# Altium schematic sheet FETS.SchDoc
size B; Address1: MILWAUKEE TOOL; Address2: 13135 W. Lisbon Rd.; Address3: Brookfield, WI 53005; SheetNumber: 1; SheetTotal: 1
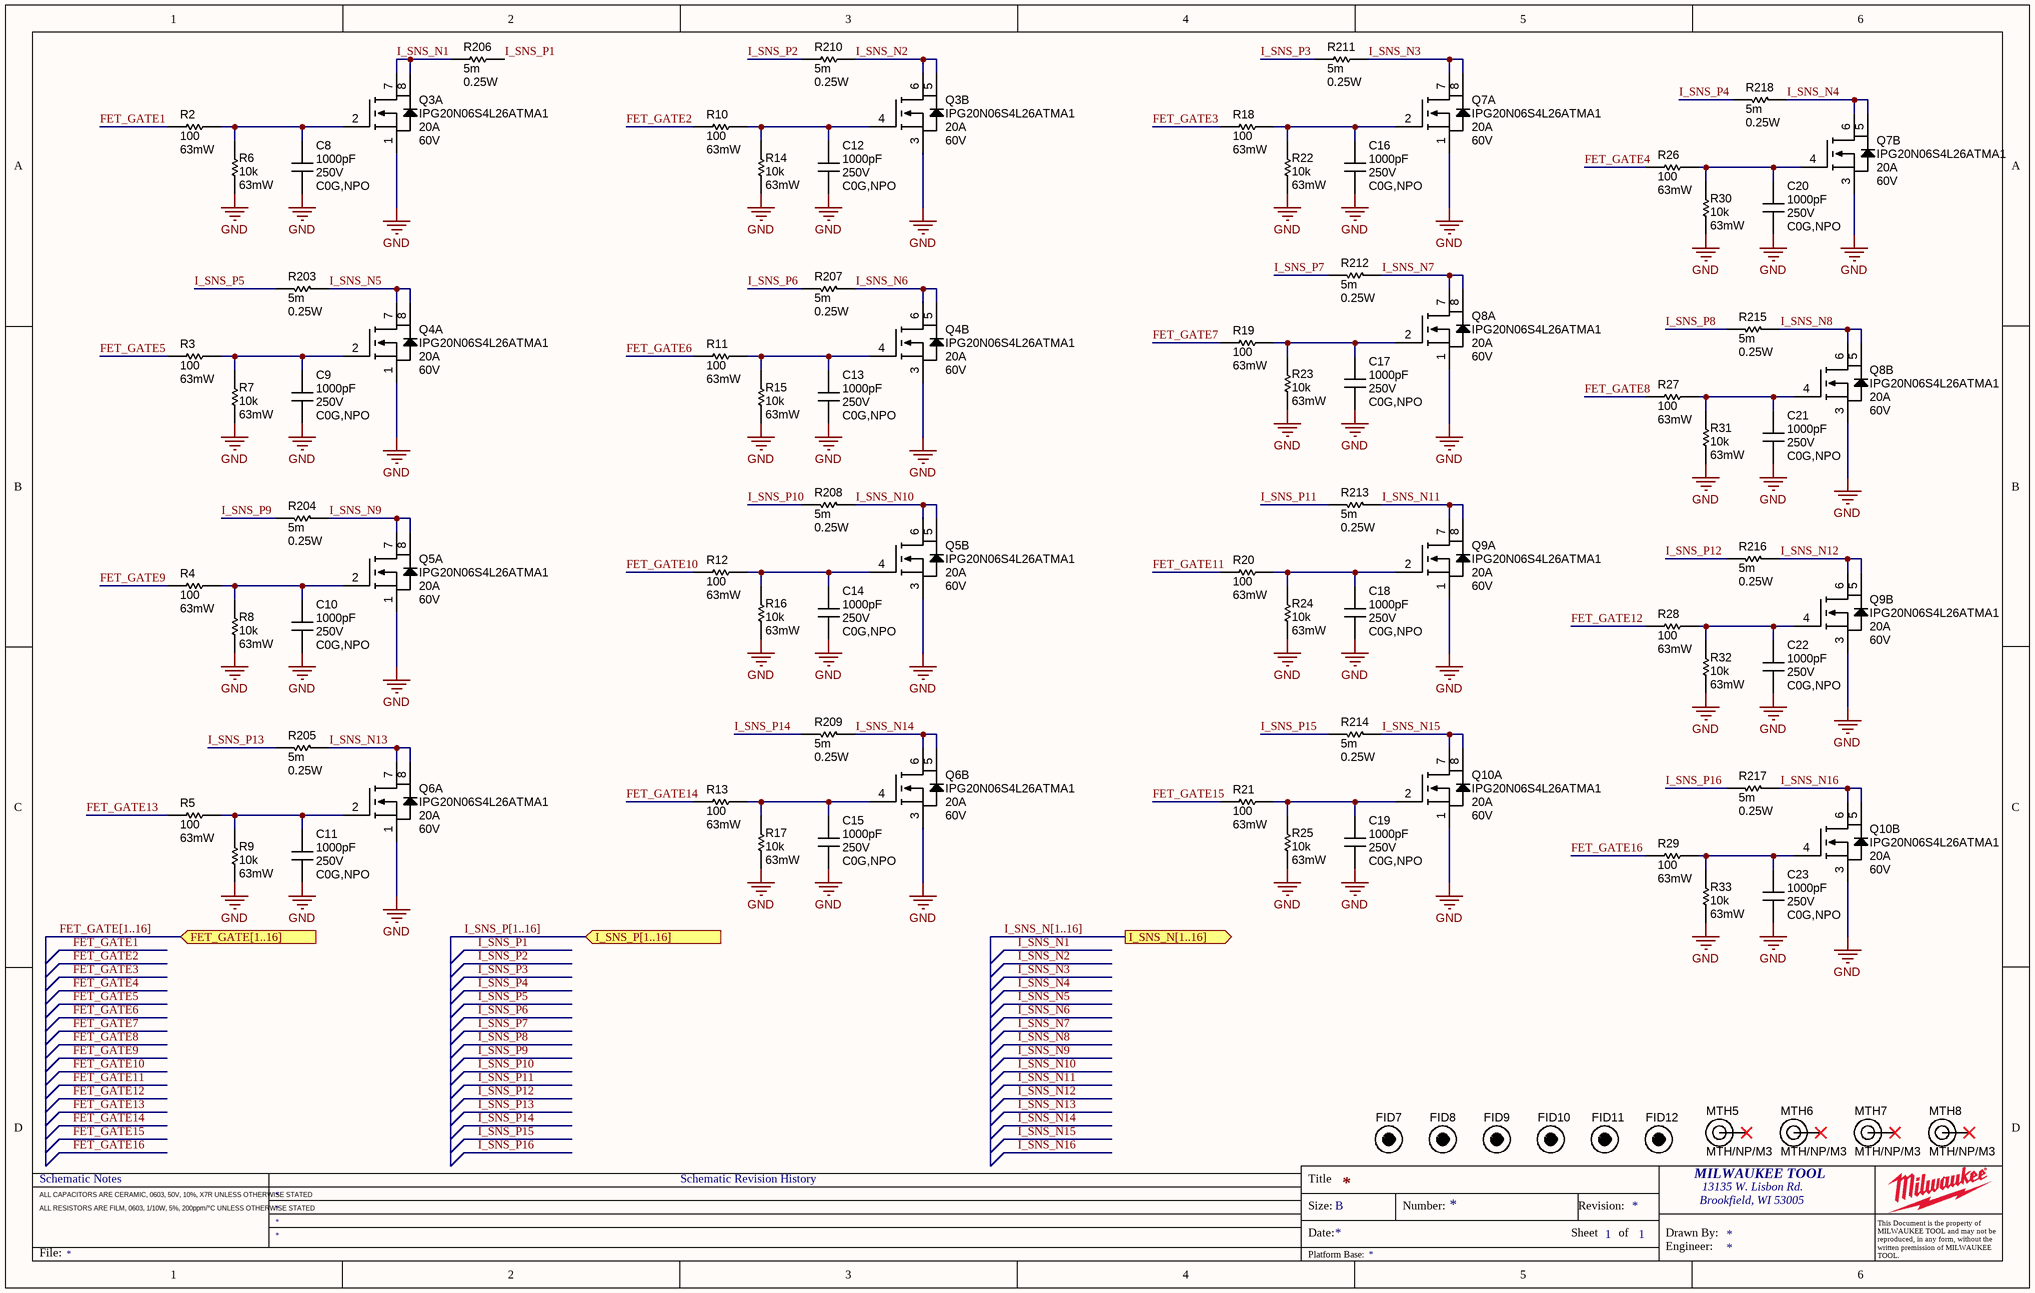
[diagram p0: FETS.SchDoc]

## Parts
C8  1000pF  Voltage Rating: 250V  Temp Coeff: C0G,NPO  [CAPC1608X09N]
C9  1000pF  Voltage Rating: 250V  Temp Coeff: C0G,NPO  [CAPC1608X09N]
C10  1000pF  Voltage Rating: 250V  Temp Coeff: C0G,NPO  [CAPC1608X09N]
C11  1000pF  Voltage Rating: 250V  Temp Coeff: C0G,NPO  [CAPC1608X09N]
C12  1000pF  Voltage Rating: 250V  Temp Coeff: C0G,NPO  [CAPC1608X09N]
C13  1000pF  Voltage Rating: 250V  Temp Coeff: C0G,NPO  [CAPC1608X09N]
C14  1000pF  Voltage Rating: 250V  Temp Coeff: C0G,NPO  [CAPC1608X09N]
C15  1000pF  Voltage Rating: 250V  Temp Coeff: C0G,NPO  [CAPC1608X09N]
C16  1000pF  Voltage Rating: 250V  Temp Coeff: C0G,NPO  [CAPC1608X09N]
C17  1000pF  Voltage Rating: 250V  Temp Coeff: C0G,NPO  [CAPC1608X09N]
C18  1000pF  Voltage Rating: 250V  Temp Coeff: C0G,NPO  [CAPC1608X09N]
C19  1000pF  Voltage Rating: 250V  Temp Coeff: C0G,NPO  [CAPC1608X09N]
C20  1000pF  Voltage Rating: 250V  Temp Coeff: C0G,NPO  [CAPC1608X09N]
C21  1000pF  Voltage Rating: 250V  Temp Coeff: C0G,NPO  [CAPC1608X09N]
C22  1000pF  Voltage Rating: 250V  Temp Coeff: C0G,NPO  [CAPC1608X09N]
C23  1000pF  Voltage Rating: 250V  Temp Coeff: C0G,NPO  [CAPC1608X09N]
FID7  FIDUCIAL STANDARD  [FID]  (value not drawn)  (no BOM)
FID8  FIDUCIAL STANDARD  [FID]  (value not drawn)  (no BOM)
FID9  FIDUCIAL STANDARD  [FID]  (value not drawn)  (no BOM)
FID10  FIDUCIAL STANDARD  [FID]  (value not drawn)  (no BOM)
FID11  FIDUCIAL STANDARD  [FID]  (value not drawn)  (no BOM)
FID12  FIDUCIAL STANDARD  [FID]  (value not drawn)  (no BOM)
MTH5  MTH/NP/M3  [MTGNP700H325Z700P]  (no BOM)
MTH6  MTH/NP/M3  [MTGNP700H325Z700P]  (no BOM)
MTH7  MTH/NP/M3  [MTGNP700H325Z700P]  (no BOM)
MTH8  MTH/NP/M3  [MTGNP700H325Z700P]  (no BOM)
Q3  IPG20N06S4L26ATMA1  Current: 20A  Voltage: 60V  [INF-PG-TDSON-8-4]  (parts A,B of 2)
Q4  IPG20N06S4L26ATMA1  Current: 20A  Voltage: 60V  [INF-PG-TDSON-8-4]  (parts A,B of 2)
Q5  IPG20N06S4L26ATMA1  Current: 20A  Voltage: 60V  [INF-PG-TDSON-8-4]  (parts A,B of 2)
Q6  IPG20N06S4L26ATMA1  Current: 20A  Voltage: 60V  [INF-PG-TDSON-8-4]  (parts A,B of 2)
Q7  IPG20N06S4L26ATMA1  Current: 20A  Voltage: 60V  [INF-PG-TDSON-8-4]  (parts A,B of 2)
Q8  IPG20N06S4L26ATMA1  Current: 20A  Voltage: 60V  [INF-PG-TDSON-8-4]  (parts A,B of 2)
Q9  IPG20N06S4L26ATMA1  Current: 20A  Voltage: 60V  [INF-PG-TDSON-8-4]  (parts A,B of 2)
Q10  IPG20N06S4L26ATMA1  Current: 20A  Voltage: 60V  [INF-PG-TDSON-8-4]  (parts A,B of 2)
R2  100  Wattage: 63mW  [RESC1005X04N]
R3  100  Wattage: 63mW  [RESC1005X04N]
R4  100  Wattage: 63mW  [RESC1005X04N]
R5  100  Wattage: 63mW  [RESC1005X04N]
R6  10k  Wattage: 63mW  [RESC1005X04N]
R7  10k  Wattage: 63mW  [RESC1005X04N]
R8  10k  Wattage: 63mW  [RESC1005X04N]
R9  10k  Wattage: 63mW  [RESC1005X04N]
R10  100  Wattage: 63mW  [RESC1005X04N]
R11  100  Wattage: 63mW  [RESC1005X04N]
R12  100  Wattage: 63mW  [RESC1005X04N]
R13  100  Wattage: 63mW  [RESC1005X04N]
R14  10k  Wattage: 63mW  [RESC1005X04N]
R15  10k  Wattage: 63mW  [RESC1005X04N]
R16  10k  Wattage: 63mW  [RESC1005X04N]
R17  10k  Wattage: 63mW  [RESC1005X04N]
R18  100  Wattage: 63mW  [RESC1005X04N]
R19  100  Wattage: 63mW  [RESC1005X04N]
R20  100  Wattage: 63mW  [RESC1005X04N]
R21  100  Wattage: 63mW  [RESC1005X04N]
R22  10k  Wattage: 63mW  [RESC1005X04N]
R23  10k  Wattage: 63mW  [RESC1005X04N]
R24  10k  Wattage: 63mW  [RESC1005X04N]
R25  10k  Wattage: 63mW  [RESC1005X04N]
R26  100  Wattage: 63mW  [RESC1005X04N]
R27  100  Wattage: 63mW  [RESC1005X04N]
R28  100  Wattage: 63mW  [RESC1005X04N]
R29  100  Wattage: 63mW  [RESC1005X04N]
R30  10k  Wattage: 63mW  [RESC1005X04N]
R31  10k  Wattage: 63mW  [RESC1005X04N]
R32  10k  Wattage: 63mW  [RESC1005X04N]
R33  10k  Wattage: 63mW  [RESC1005X04N]
R203  5m  Wattage: 0.25W  [RESC3115X07N]
R204  5m  Wattage: 0.25W  [RESC3115X07N]
R205  5m  Wattage: 0.25W  [RESC3115X07N]
R206  5m  Wattage: 0.25W  [RESC3115X07N]
R207  5m  Wattage: 0.25W  [RESC3115X07N]
R208  5m  Wattage: 0.25W  [RESC3115X07N]
R209  5m  Wattage: 0.25W  [RESC3115X07N]
R210  5m  Wattage: 0.25W  [RESC3115X07N]
R211  5m  Wattage: 0.25W  [RESC3115X07N]
R212  5m  Wattage: 0.25W  [RESC3115X07N]
R213  5m  Wattage: 0.25W  [RESC3115X07N]
R214  5m  Wattage: 0.25W  [RESC3115X07N]
R215  5m  Wattage: 0.25W  [RESC3115X07N]
R216  5m  Wattage: 0.25W  [RESC3115X07N]
R217  5m  Wattage: 0.25W  [RESC3115X07N]
R218  5m  Wattage: 0.25W  [RESC3115X07N]

## Ports
FET_GATE[1..16] (in), I_SNS_N[1..16] (out), I_SNS_P[1..16] (in)

## Nets
GND: C8.2 C9.2 C10.2 C11.2 C12.2 C13.2 C14.2 C15.2 C16.2 C17.2 C18.2 C19.2 C20.2 C21.2 C22.2 C23.2 Q3.1(S) Q3.3(S) Q4.1(S) Q4.3(S) Q5.1(S) Q5.3(S) Q6.1(S) Q6.3(S) Q7.1(S) Q7.3(S) Q8.1(S) Q8.3(S) Q9.1(S) Q9.3(S) Q10.1(S) Q10.3(S) R6.1 R7.1 R8.1 R9.1 R14.1 R15.1 R16.1 R17.1 R22.1 R23.1 R24.1 R25.1 R30.1 R31.1 R32.1 R33.1
FET_GATE1: R2.1
FET_GATE2: R10.1
FET_GATE3: R18.1
FET_GATE4: R26.1
FET_GATE5: R3.1
FET_GATE6: R11.1
FET_GATE7: R19.1
FET_GATE8: R27.1
FET_GATE9: R4.1
FET_GATE10: R12.1
FET_GATE11: R20.1
FET_GATE12: R28.1
FET_GATE13: R5.1
FET_GATE14: R13.1
FET_GATE15: R21.1
FET_GATE16: R29.1
I_SNS_N1: Q3.7(D) Q3.8(D) R206.1
I_SNS_N2: Q3.5(D) Q3.6(D) R210.2
I_SNS_N3: Q7.7(D) Q7.8(D) R211.2
I_SNS_N4: Q7.5(D) Q7.6(D) R218.1
I_SNS_N5: Q4.7(D) Q4.8(D) R203.1
I_SNS_N6: Q4.5(D) Q4.6(D) R207.1
I_SNS_N7: Q8.7(D) Q8.8(D) R212.1
I_SNS_N8: Q8.5(D) Q8.6(D) R215.1
I_SNS_N9: Q5.7(D) Q5.8(D) R204.1
I_SNS_N10: Q5.5(D) Q5.6(D) R208.1
I_SNS_N11: Q9.7(D) Q9.8(D) R213.1
I_SNS_N12: Q9.5(D) Q9.6(D) R216.1
I_SNS_N13: Q6.7(D) Q6.8(D) R205.1
I_SNS_N14: Q6.5(D) Q6.6(D) R209.1
I_SNS_N15: Q10.7(D) Q10.8(D) R214.1
I_SNS_N16: Q10.5(D) Q10.6(D) R217.1
I_SNS_P1: R206.2
I_SNS_P2: R210.1
I_SNS_P3: R211.1
I_SNS_P4: R218.2
I_SNS_P5: R203.2
I_SNS_P6: R207.2
I_SNS_P7: R212.2
I_SNS_P8: R215.2
I_SNS_P9: R204.2
I_SNS_P10: R208.2
I_SNS_P11: R213.2
I_SNS_P12: R216.2
I_SNS_P13: R205.2
I_SNS_P14: R209.2
I_SNS_P15: R214.2
I_SNS_P16: R217.2
NetC8_1: C8.1 Q3.2(G) R2.2 R6.2
NetC9_1: C9.1 Q4.2(G) R3.2 R7.2
NetC10_1: C10.1 Q5.2(G) R4.2 R8.2
NetC11_1: C11.1 Q6.2(G) R5.2 R9.2
NetC12_1: C12.1 Q3.4(G) R10.2 R14.2
NetC13_1: C13.1 Q4.4(G) R11.2 R15.2
NetC14_1: C14.1 Q5.4(G) R12.2 R16.2
NetC15_1: C15.1 Q6.4(G) R13.2 R17.2
NetC16_1: C16.1 Q7.2(G) R18.2 R22.2
NetC17_1: C17.1 Q8.2(G) R19.2 R23.2
NetC18_1: C18.1 Q9.2(G) R20.2 R24.2
NetC19_1: C19.1 Q10.2(G) R21.2 R25.2
NetC20_1: C20.1 Q7.4(G) R26.2 R30.2
NetC21_1: C21.1 Q8.4(G) R27.2 R31.2
NetC22_1: C22.1 Q9.4(G) R28.2 R32.2
NetC23_1: C23.1 Q10.4(G) R29.2 R33.2

Not connected (* = marked no-connect by the designer): MTH5 1*; MTH6 1*; MTH7 1*; MTH8 1*

## Buses and harness runs
bus FET_GATE[1..16] = port FET_GATE[1..16]
bus I_SNS_N[1..16] = port I_SNS_N[1..16]
bus I_SNS_P[1..16] = port I_SNS_P[1..16]

## Notes on the sheet
- Schematic Notes
- Schematic Revision History
- Title
- ALL CAPACITORS ARE CERAMIC, 0603, 50V, 10%, X7R UNLESS OTHERWISE STATED
- ALL RESISTORS ARE FILM, 0603, 1/10W, 5%, 200ppm/°C UNLESS OTHERWISE STATED
- Size:
- Date:
- B
- Number:
- Sheet
- Revision:
- of
- Drawn By:
- Brookfield, WI 53005
- File:
- Platform Base:
- Engineer:
- This Document is the property of MILWAUKEE TOOL and may not be reproduced, in any form, without the written premission of MILWAUKEE TOOL.

## Library data of the parts
C8-C23 = CMP-004-0013: CAP CER 1000PF 250V X7R 0603; MFR2#: C1608C0G2E102J080AA; MFR: KEMET; MFR#: C0603C102JAGAC7867; Tolerance: 5%; Capacitor Type: Ceramic; Temp Range: -55 / +125 C; Case Code (Imperial): 0603; Value: 1000pF; ComponentLink1Description: Datasheet; ComponentLink1URL: https://api.kemet.com/component-edge/download/datasheet/C0603C102K1RAC7411.pdf; RoHS Compliant: Yes; Design Item ID: CN/1000PF/250V/C0G,NPO/5%/0603; MFR2: TDK Corporation; REACH SVHC: Yes; Case Code (Metric): 1608
FID7-FID12 = CMP-019-0003: STANDARD PCB FIDUCIAL; Populate: DNP; Soldermask Dimensions: 1.3mm; Copper Dimensions: 1mm; Design Item ID: Fiducial, Standard
MTH5-MTH8 = CMP-022-0003: M3 Screw Mounted Hole Non-Plated; Drill size: 3.25mm; Annular Ring Size: 7mm; Bolt Diameter: 3mm; Populate: DNP; Bolt Head Size: 6.3mm; Design Item ID: MTH/NP/M3; ClassName: MTHole
Q3-Q10 = CMP-029-0047: MOSFET N-CH 25V 5.8A SOT23; MFR: Infineon; Rth(j-c): 4.5 C/W; Wattage: 33W; Rth(j-a): 100 C/W; Transistor Type: NCH; Populate: Yes; Temp Range, Junction: -55 / +175 C; Design Item ID: Q/NCH/D/60V/20A/IPG20N06S4L26ATMA1/8tdson; MFR#: IPG20N06S4L26ATMA1; Case/Package: PG-TDSON-8; REACH SVHC: No SVHC; Value: IPG20N06S4L26ATMA1; RoHS Compliant: Yes; Part Status: Production; ComponentLink1URL: https://www.diodes.com/assets/Datasheets/ds30041.pdf; ComponentLink1Description: Datasheet; Temp Range, Ambient: -55 / +175 C
R2-R5 R10-R13 R18-R21 R26-R29 = CMP-025-0156: RES SMD 100 OHM 1% 1/16W 0402; MFR4#: CR0402-FX-1000GLF; MFR#: RMCF0402FT100R; MFR: Stackpole Electronics Inc; MFR3#: CRCW0402100RFKED; MFR2#: RC0402FR-07100RL; Value: 100 Ohm; Voltage Rating: 75V; Temp Range: -55 / +155 C; Current: 1A; Temperature Coefficient: 100ppm/°C; Populate: Yes; MFR2: YAGEO; Tolerance: 1%; MFR3: Vishay Dale; ComponentLink1Description: Datasheet; ComponentLink1URL: https://www.yageo.com/upload/media/product/products/datasheet/rchip/PYu-RC_Group_51_RoHS_L_12.pdf; Resistor Type: Thick Film; Case Code (Imperial): 0402; MFR4: Bourns Inc; Case Code (Metric): 1005; Design Item ID: R/100.0/0.063W/1%/0402; RoHS Compliant: Yes
R6-R9 R14-R17 R22-R25 R30-R33 = CMP-025-0026: RES SMD 10K OHM 0.5% 1/16W 0402; MFR2#: RNCF0402DTE10K0; MFR#: ERA-2AED103X; MFR: Panasonic Electronic Components; Temp Range: -55 / +155 C; Voltage Rating: 50V; Temperature Coefficient: 25ppm/°C; Quality: AEC-Q200; MFR2: Stackpole Electronics Inc; RoHS Compliant: Yes; ComponentLink1Description: Datasheet; REACH SVHC: Yes; Value: 10k; Case Code (Imperial): 0402; Case Code (Metric): 1005; Tolerance: 0.5%; Resistor Type: Thick Film; Design Item ID: R/10.0K/0.063W/0.5%/0402; ComponentLink1URL: https://industrial.panasonic.com/cdbs/www-data/pdf/RDM0000/AOA0000C307.pdf
R203-R218 = CMP-025-0170: RES SMD 5m OHM 1% 1/4W 1206; MFR#: PE1206FRF070R005L; MFR: YAGEO; Value: 5m Ohm; Voltage Rating: 250V; Temp Range: -55 / +155 C; Current: 6A; Temperature Coefficient: 600ppm/°C; Populate: Yes; Tolerance: 1%; ComponentLink1Description: Datasheet; ComponentLink1URL: https://www.yageo.com/upload/media/product/app/datasheet/rchip/pyu-rl_group_521_rohs_l.pdf; Resistor Type: Thick Film; Case Code (Imperial): 1206; Case Code (Metric): 3216; Design Item ID: R/0.005/0.25W/1%/1206; RoHS Compliant: Yes; Part Status: Production